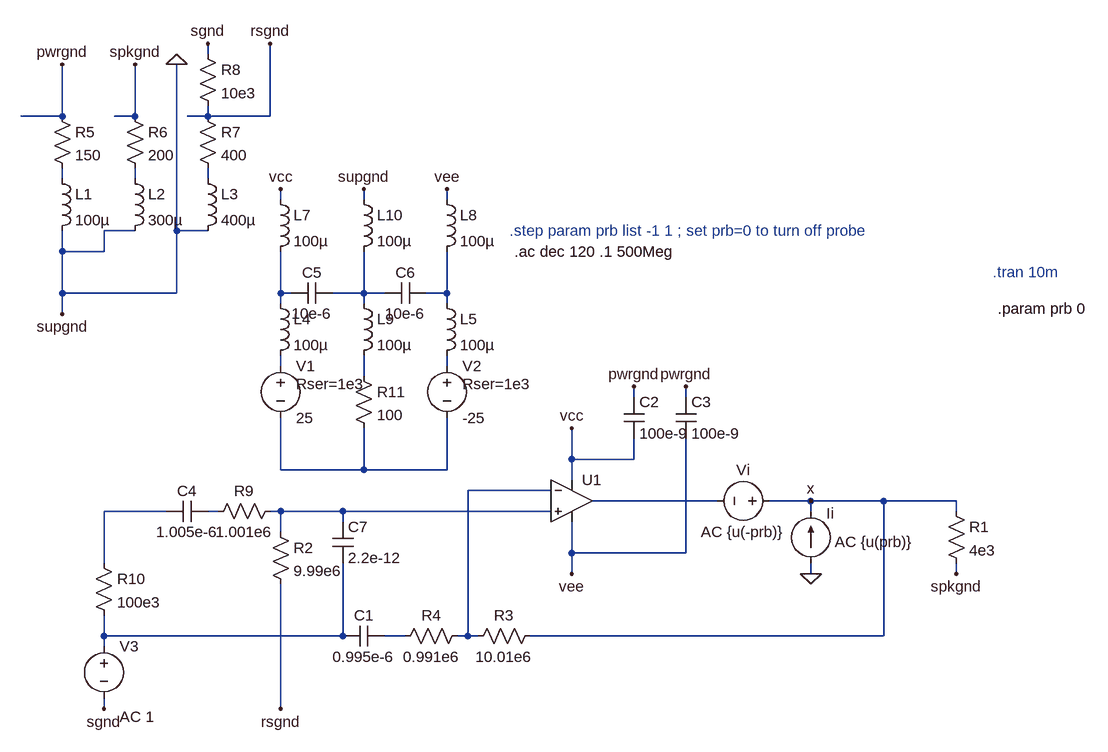
[diagram p0: schematic grounding.asc]
grounding.asc, the LTspice schematic file:
Version 4
SHEET 1 1412 808
WIRE -304 -464 -304 -480
WIRE -528 -368 -528 -448
WIRE -528 -368 -592 -368
WIRE -416 -368 -416 -448
WIRE -416 -368 -448 -368
WIRE -304 -368 -304 -384
WIRE -304 -368 -336 -368
WIRE -208 -368 -208 -480
WIRE -208 -368 -304 -368
WIRE -528 -272 -528 -288
WIRE -416 -272 -416 -288
WIRE -304 -272 -304 -288
WIRE -192 -240 -192 -256
WIRE -64 -240 -64 -256
WIRE 64 -240 64 -256
WIRE -416 -192 -464 -192
WIRE -352 -192 -352 -448
WIRE -304 -192 -352 -192
WIRE -528 -160 -528 -192
WIRE -464 -160 -464 -192
WIRE -464 -160 -528 -160
WIRE -528 -96 -528 -160
WIRE -352 -96 -352 -192
WIRE -352 -96 -528 -96
WIRE -192 -96 -192 -160
WIRE -176 -96 -192 -96
WIRE -64 -96 -64 -160
WIRE -64 -96 -112 -96
WIRE -32 -96 -64 -96
WIRE 64 -96 64 -160
WIRE 64 -96 32 -96
WIRE -192 -80 -192 -96
WIRE -64 -80 -64 -96
WIRE 64 -80 64 -96
WIRE -528 -64 -528 -96
WIRE -192 16 -192 0
WIRE 64 16 64 0
WIRE -64 32 -64 0
WIRE 352 64 352 48
WIRE 432 64 432 48
WIRE 256 160 256 112
WIRE 352 160 352 128
WIRE 352 160 256 160
WIRE -192 176 -192 96
WIRE -64 176 -64 112
WIRE -64 176 -192 176
WIRE 64 176 64 96
WIRE 64 176 -64 176
WIRE 256 192 256 160
WIRE 224 208 96 208
WIRE 480 224 288 224
WIRE 624 224 560 224
WIRE 736 224 624 224
WIRE 848 224 736 224
WIRE -368 240 -464 240
WIRE -288 240 -304 240
WIRE -192 240 -208 240
WIRE -96 240 -192 240
WIRE 224 240 -96 240
WIRE 624 240 624 224
WIRE 848 240 848 224
WIRE -96 256 -96 240
WIRE -192 272 -192 240
WIRE 256 304 256 256
WIRE 432 304 432 128
WIRE 432 304 256 304
WIRE -464 320 -464 240
WIRE 256 336 256 304
WIRE 624 336 624 320
WIRE 848 336 848 320
WIRE -464 432 -464 400
WIRE -96 432 -96 320
WIRE -96 432 -464 432
WIRE 0 432 -32 432
WIRE 96 432 96 208
WIRE 96 432 80 432
WIRE 112 432 96 432
WIRE 736 432 736 224
WIRE 736 432 192 432
WIRE -464 448 -464 432
WIRE -464 544 -464 528
WIRE -192 544 -192 352
FLAG -192 -256 vcc
FLAG 64 -256 vee
FLAG 256 336 vee
FLAG 256 112 vcc
FLAG 624 336 0
FLAG 624 224 x
FLAG -528 -448 pwrgnd
FLAG -416 -448 spkgnd
FLAG -304 -480 sgnd
FLAG 352 48 pwrgnd
FLAG 432 48 pwrgnd
FLAG -352 -448 0
FLAG -64 -256 supgnd
FLAG -528 -64 supgnd
FLAG -464 544 sgnd
FLAG 848 336 spkgnd
FLAG -208 -480 rsgnd
FLAG -192 544 rsgnd
SYMBOL Opamps\\UniversalOpamp2 256 224 R0
SYMATTR InstName U1
SYMBOL voltage -192 0 R0
WINDOW 123 0 0 Left 2
WINDOW 39 24 44 Left 2
SYMATTR SpiceLine Rser=1e3
SYMATTR InstName V1
SYMATTR Value 25
SYMBOL voltage 64 0 R0
WINDOW 123 0 0 Left 2
WINDOW 39 24 44 Left 2
SYMATTR SpiceLine Rser=1e3
SYMATTR InstName V2
SYMATTR Value -25
SYMBOL current 624 320 M180
WINDOW 0 24 77 Left 2
WINDOW 3 24 0 Left 2
WINDOW 123 37 33 Left 2
WINDOW 39 0 0 Left 2
SYMATTR InstName Ii
SYMATTR Value ""
SYMATTR Value2 AC {u(prb)}
SYMBOL voltage 576 224 M270
WINDOW 0 32 56 VTop 2
WINDOW 3 -32 56 VBottom 2
WINDOW 123 -32 56 VBottom 2
WINDOW 39 -32 56 VBottom 2
SYMATTR InstName Vi
SYMATTR Value ""
SYMATTR Value2 AC {u(-prb)}
SYMBOL res 832 224 R0
SYMATTR InstName R1
SYMATTR Value 4e3
SYMBOL res -208 256 R0
SYMATTR InstName R2
SYMATTR Value 9.99e6
SYMBOL res 208 416 R90
WINDOW 0 0 56 VBottom 2
WINDOW 3 32 56 VTop 2
SYMATTR InstName R3
SYMATTR Value 10.01e6
SYMBOL res 96 416 R90
WINDOW 0 0 56 VBottom 2
WINDOW 3 32 56 VTop 2
SYMATTR InstName R4
SYMATTR Value 0.991e6
SYMBOL cap -32 416 R90
WINDOW 0 0 32 VBottom 2
WINDOW 3 32 32 VTop 2
SYMATTR InstName C1
SYMATTR Value 0.995e-6
SYMBOL res -544 -384 R0
SYMATTR InstName R5
SYMATTR Value 150
SYMBOL res -432 -384 R0
SYMATTR InstName R6
SYMATTR Value 200
SYMBOL res -320 -384 R0
SYMATTR InstName R7
SYMATTR Value 400
SYMBOL cap 336 64 R0
SYMATTR InstName C2
SYMATTR Value 100e-9
SYMBOL ind -544 -288 R0
SYMATTR InstName L1
SYMATTR Value 100µ
SYMBOL ind -432 -288 R0
SYMATTR InstName L2
SYMATTR Value 300µ
SYMBOL ind -320 -288 R0
SYMATTR InstName L3
SYMATTR Value 400µ
SYMBOL ind -208 -96 R0
SYMATTR InstName L4
SYMATTR Value 100µ
SYMBOL ind 48 -96 R0
SYMATTR InstName L5
SYMATTR Value 100µ
SYMBOL res -320 -480 R0
SYMATTR InstName R8
SYMATTR Value 10e3
SYMBOL res -192 224 R90
WINDOW 0 0 56 VBottom 2
WINDOW 3 32 56 VTop 2
SYMATTR InstName R9
SYMATTR Value 1.001e6
SYMBOL cap -304 224 R90
WINDOW 0 0 32 VBottom 2
WINDOW 3 32 32 VTop 2
SYMATTR InstName C4
SYMATTR Value 1.005e-6
SYMBOL cap -112 -112 R90
WINDOW 0 0 32 VBottom 2
WINDOW 3 32 32 VTop 2
SYMATTR InstName C5
SYMATTR Value 10e-6
SYMBOL cap 416 64 R0
SYMATTR InstName C3
SYMATTR Value 100e-9
SYMBOL cap 32 -112 R90
WINDOW 0 0 32 VBottom 2
WINDOW 3 32 32 VTop 2
SYMATTR InstName C6
SYMATTR Value 10e-6
SYMBOL ind -208 -256 R0
SYMATTR InstName L7
SYMATTR Value 100µ
SYMATTR SpiceLine Rser=100
SYMBOL ind 48 -256 R0
SYMATTR InstName L8
SYMATTR Value 100µ
SYMATTR SpiceLine Rser=100
SYMBOL ind -80 -96 R0
SYMATTR InstName L9
SYMATTR Value 100µ
SYMBOL res -80 16 R0
SYMATTR InstName R11
SYMATTR Value 100
SYMBOL ind -80 -256 R0
SYMATTR InstName L10
SYMATTR Value 100µ
SYMATTR SpiceLine Rser=100
SYMBOL cap -112 256 R0
SYMATTR InstName C7
SYMATTR Value 2.2e-12
SYMBOL voltage -464 432 R0
WINDOW 123 24 124 Left 2
WINDOW 39 0 0 Left 0
SYMATTR InstName V3
SYMATTR Value ""
SYMATTR Value2 AC 1
SYMBOL res -480 304 R0
SYMATTR InstName R10
SYMATTR Value 100e3
TEXT 160 -192 Left 2 ;.step param prb list -1 1 ; set prb=0 to turn off probe
TEXT 168 -160 Left 2 !.ac dec 120 .1 500Meg
TEXT 904 -128 Left 2 ;.tran 10m
TEXT 912 -72 Left 2 !.param prb 0

The netlist it stands for:
* grounding.asc
XU1 N015 N011 vcc vee N012 level.2 Avol=1Meg GBW=10Meg Slew=10Meg ilimit=25m rail=0 Vos=0 phimargin=45 en=0 enk=0 in=0 ink=0 Rin=500Meg  ; pins IN+ IN- V+ V- OUT
V1 N007 N010 25 Rser=1e3
V2 N008 N010 -25 Rser=1e3
Ii 0 x AC {u(prb)}
Vi x N012 AC {u(-prb)}
R1 x spkgnd 4e3
R2 N015 rsgnd 9.99e6
R3 x N011 10.01e6
R4 N011 N017 0.991e6
C1 N017 N016 0.995e-6
R5 pwrgnd N001 150
R6 spkgnd N002 200
R7 rsgnd N003 400
C2 pwrgnd vcc 100e-9
L1 N001 0 100µ
L2 N002 0 300µ
L3 N003 0 400µ
L4 N004 N007 100µ
L5 N006 N008 100µ
R8 sgnd rsgnd 10e3
R9 N015 N014 1.001e6
C4 N014 N013 1.005e-6
C5 N005 N004 10e-6
C3 pwrgnd vee 100e-9
C6 N006 N005 10e-6
L7 vcc N004 100µ Rser=100
L8 vee N006 100µ Rser=100
L9 N005 N009 100µ
R11 N009 N010 100
L10 0 N005 100µ Rser=100
C7 N015 N016 2.2e-12
V3 N016 sgnd AC 1
R10 N013 N016 100e3
* .step param prb list -1 1 ; set prb=0 to turn off probe
.ac dec 120 .1 500Meg
* .tran 10m
.param prb 0
.lib UniversalOpamps2.sub
.backanno
.end